# Altium schematic sheet K7410tFFG900MGT.SchDoc
size A3
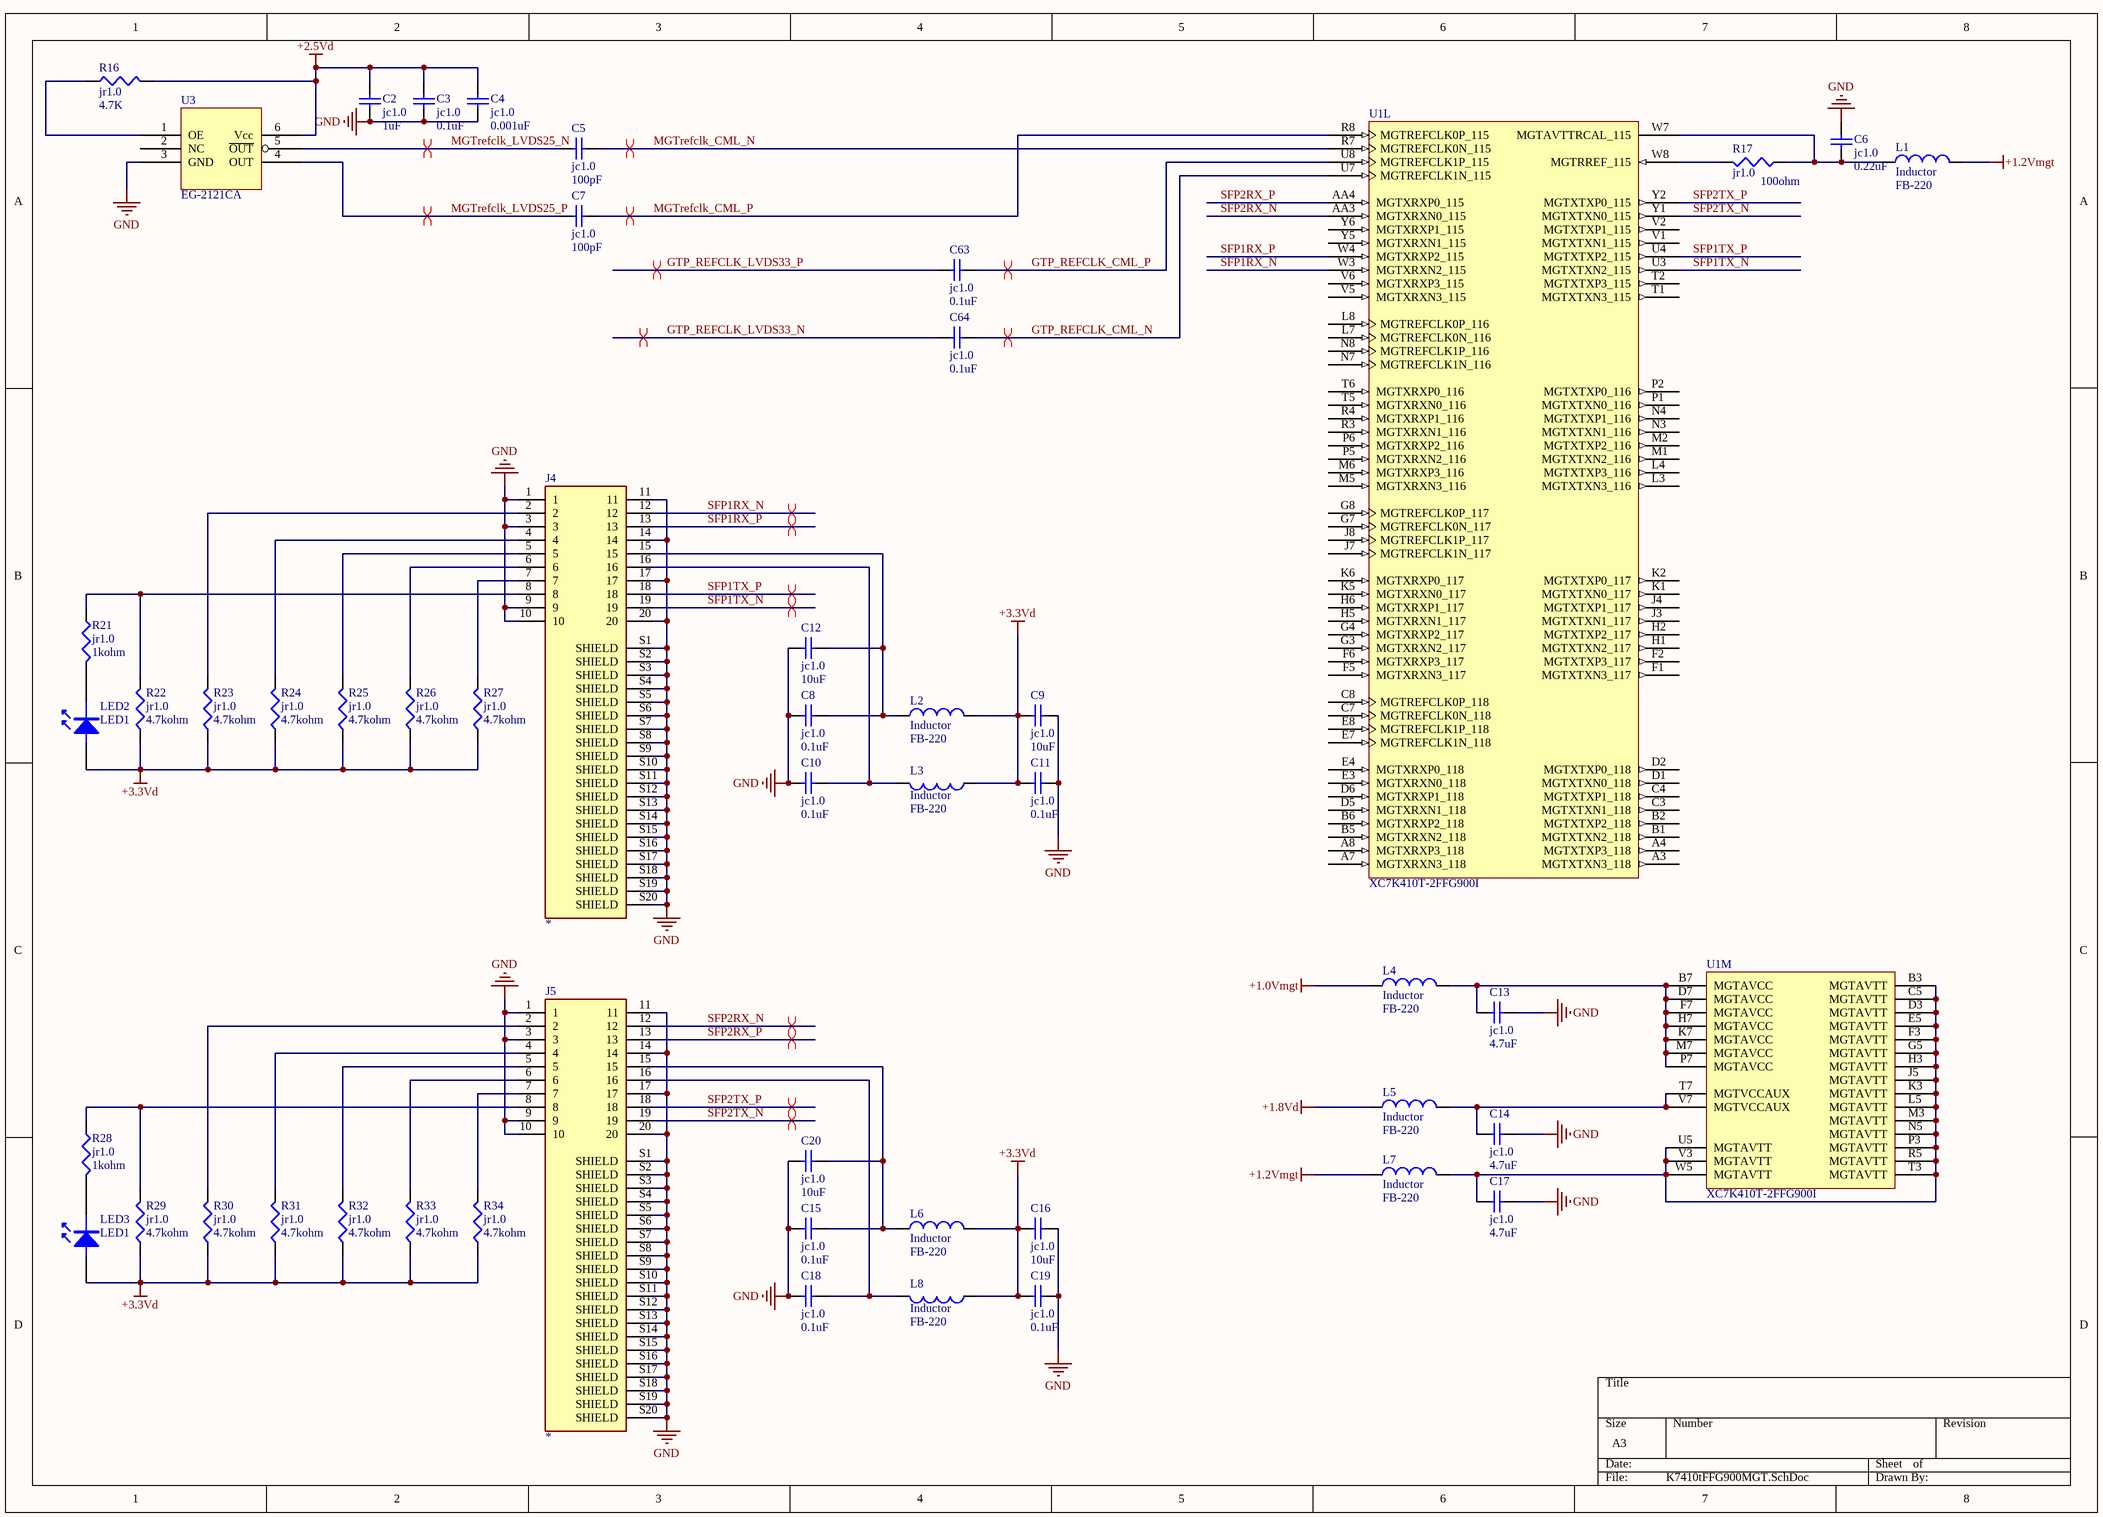
[diagram p0: K7410tFFG900MGT.SchDoc]

## Parts
C2  jc1.0  value 1uF  [0402]
C3  jc1.0  value 0.1uF  [0402]
C4  jc1.0  value 0.001uF  [0402]
C5  jc1.0  value 100pF  [0402]
C6  jc1.0  value 0.22uF  [0402]
C7  jc1.0  value 100pF  [0402]
C8  jc1.0  value 0.1uF  [0805]
C9  jc1.0  value 10uF  [0805]
C10  jc1.0  value 0.1uF  [0805]
C11  jc1.0  value 0.1uF  [0805]
C12  jc1.0  value 10uF  [0805]
C13  jc1.0  value 4.7uF  [0402]
C14  jc1.0  value 4.7uF  [0402]
C15  jc1.0  value 0.1uF  [0805]
C16  jc1.0  value 10uF  [0805]
C17  jc1.0  value 4.7uF  [0402]
C18  jc1.0  value 0.1uF  [0805]
C19  jc1.0  value 0.1uF  [0805]
C20  jc1.0  value 10uF  [0805]
C63  jc1.0  value 0.1uF  [0402]
C64  jc1.0  value 0.1uF  [0402]
J4  2227023-1  [TE_2227023-1]  (value not drawn)
J5  2227023-1  [TE_2227023-1]  (value not drawn)
L1  Inductor  value FB-220  [0603]
L2  Inductor  value FB-220  [1210]
L3  Inductor  value FB-220  [1210]
L4  Inductor  value FB-220  [1210]
L5  Inductor  value FB-220  [1210]
L6  Inductor  value FB-220  [1210]
L7  Inductor  value FB-220  [1210]
L8  Inductor  value FB-220  [1210]
LED2  LED1  [LED1]
LED3  LED1  [LED1]
R16  jr1.0  value 4.7K  [0402]
R17  jr1.0  value 100ohm  [0402]
R21  jr1.0  value 1kohm  [0402]
R22  jr1.0  value 4.7kohm  [0402]
R23  jr1.0  value 4.7kohm  [0402]
R24  jr1.0  value 4.7kohm  [0402]
R25  jr1.0  value 4.7kohm  [0402]
R26  jr1.0  value 4.7kohm  [0402]
R27  jr1.0  value 4.7kohm  [0402]
R28  jr1.0  value 1kohm  [0402]
R29  jr1.0  value 4.7kohm  [0402]
R30  jr1.0  value 4.7kohm  [0402]
R31  jr1.0  value 4.7kohm  [0402]
R32  jr1.0  value 4.7kohm  [0402]
R33  jr1.0  value 4.7kohm  [0402]
R34  jr1.0  value 4.7kohm  [0402]
U1  XC7K410T-2FFG900I  [FFG900]  (parts L,M of 16)
U3  EG-2121CA  [DFN3]

## Nets
+1.0Vmgt: L4.1
+1.2Vmgt: L1.2 L7.1
+1.8Vd: L5.1
+2.5Vd: C2.2 C3.2 C4.2 R16.2 U3.6(Vcc)
+3.3Vd: C9.2 C11.2 C16.2 C19.2 L2.2 L3.1 L6.2 L8.1 LED2.1 LED3.1 R22.1 R23.1 R24.1 R25.1 R26.1 R27.1 R29.1 R30.1 R31.1 R32.1 R33.1 R34.1
GND: C2.1 C3.1 C4.1 C6.1 C8.1 C9.1 C10.1 C11.1 C12.1 C13.1 C14.1 C15.1 C16.1 C17.1 C18.1 C19.1 C20.1 J4.1 J4.3 J4.9 J4.10 J4.11 J4.14 J4.17 J4.20 J4.S1(SHIELD) J4.S2(SHIELD) J4.S3(SHIELD) J4.S4(SHIELD) J4.S5(SHIELD) J4.S6(SHIELD) J4.S7(SHIELD) J4.S8(SHIELD) J4.S9(SHIELD) J4.S10(SHIELD) J4.S11(SHIELD) J4.S12(SHIELD) J4.S13(SHIELD) J4.S14(SHIELD) J4.S15(SHIELD) J4.S16(SHIELD) J4.S17(SHIELD) J4.S18(SHIELD) J4.S19(SHIELD) J4.S20(SHIELD) J5.1 J5.3 J5.9 J5.10 J5.11 J5.14 J5.17 J5.20 J5.S1(SHIELD) J5.S2(SHIELD) J5.S3(SHIELD) J5.S4(SHIELD) J5.S5(SHIELD) J5.S6(SHIELD) J5.S7(SHIELD) J5.S8(SHIELD) J5.S9(SHIELD) J5.S10(SHIELD) J5.S11(SHIELD) J5.S12(SHIELD) J5.S13(SHIELD) J5.S14(SHIELD) J5.S15(SHIELD) J5.S16(SHIELD) J5.S17(SHIELD) J5.S18(SHIELD) J5.S19(SHIELD) J5.S20(SHIELD) U3.3(GND)
GTP_REFCLK_CML_N: C64.2 U1.U7(MGTREFCLK1N_115)
GTP_REFCLK_CML_P: C63.2 U1.U8(MGTREFCLK1P_115)
GTP_REFCLK_LVDS33_N: C64.1
GTP_REFCLK_LVDS33_P: C63.1
MGTrefclk_CML_N: C5.2 U1.R7(MGTREFCLK0N_115)
MGTrefclk_CML_P: C7.2 U1.R8(MGTREFCLK0P_115)
MGTrefclk_LVDS25_N: C5.1 U3.5(~{OUT})
MGTrefclk_LVDS25_P: C7.1 U3.4(OUT)
SFP1RX_N: J4.12 U1.W3(MGTXRXN2_115)
SFP1RX_P: J4.13 U1.W4(MGTXRXP2_115)
SFP1TX_N: J4.19 U1.U3(MGTXTXN2_115)
SFP1TX_P: J4.18 U1.U4(MGTXTXP2_115)
SFP2RX_N: J5.12 U1.AA3(MGTXRXN0_115)
SFP2RX_P: J5.13 U1.AA4(MGTXRXP0_115)
SFP2TX_N: J5.19 U1.Y1(MGTXTXN0_115)
SFP2TX_P: J5.18 U1.Y2(MGTXTXP0_115)
NetC6_2: C6.2 L1.1 R17.1 U1.W7(MGTAVTTRCAL_115)
NetC8_2: C8.2 C12.2 J4.15 L2.1
NetC10_2: C10.2 J4.16 L3.2
NetC13_2: C13.2 L4.2 U1.B7(MGTAVCC) U1.D7(MGTAVCC) U1.F7(MGTAVCC) U1.H7(MGTAVCC) U1.K7(MGTAVCC) U1.M7(MGTAVCC) U1.P7(MGTAVCC)
NetC14_2: C14.2 L5.2 U1.T7(MGTVCCAUX) U1.V7(MGTVCCAUX)
NetC15_2: C15.2 C20.2 J5.15 L6.1
NetC17_2: C17.2 L7.2 U1.B3(MGTAVTT) U1.C5(MGTAVTT) U1.D3(MGTAVTT) U1.E5(MGTAVTT) U1.F3(MGTAVTT) U1.G5(MGTAVTT) U1.H3(MGTAVTT) U1.J5(MGTAVTT) U1.K3(MGTAVTT) U1.L5(MGTAVTT) U1.M3(MGTAVTT) U1.N5(MGTAVTT) U1.P3(MGTAVTT) U1.R5(MGTAVTT) U1.T3(MGTAVTT) U1.U5(MGTAVTT) U1.V3(MGTAVTT) U1.W5(MGTAVTT)
NetC18_2: C18.2 J5.16 L8.2
NetJ4_2: J4.2 R23.2
NetJ4_4: J4.4 R24.2
NetJ4_5: J4.5 R25.2
NetJ4_6: J4.6 R26.2
NetJ4_7: J4.7 R27.2
NetJ4_8: J4.8 R21.1 R22.2
NetJ5_2: J5.2 R30.2
NetJ5_4: J5.4 R31.2
NetJ5_5: J5.5 R32.2
NetJ5_6: J5.6 R33.2
NetJ5_7: J5.7 R34.2
NetJ5_8: J5.8 R28.1 R29.2
NetLED2_2: LED2.2 R21.2
NetLED3_2: LED3.2 R28.2
NetR16_1: R16.1 U3.1(OE)
NetR17_2: R17.2 U1.W8(MGTRREF_115)

Not connected (* = marked no-connect by the designer): U1 A3(MGTXTXN3_118) A4(MGTXTXP3_118) A7(MGTXRXN3_118) A8(MGTXRXP3_118) B1(MGTXTXN2_118) B2(MGTXTXP2_118) B5(MGTXRXN2_118) B6(MGTXRXP2_118) C3(MGTXTXN1_118) C4(MGTXTXP1_118) C7(MGTREFCLK0N_118) C8(MGTREFCLK0P_118) D1(MGTXTXN0_118) D2(MGTXTXP0_118) D5(MGTXRXN1_118) D6(MGTXRXP1_118) E3(MGTXRXN0_118) E4(MGTXRXP0_118) E7(MGTREFCLK1N_118) E8(MGTREFCLK1P_118) F1(MGTXTXN3_117) F2(MGTXTXP3_117) F5(MGTXRXN3_117) F6(MGTXRXP3_117) G3(MGTXRXN2_117) G4(MGTXRXP2_117) G7(MGTREFCLK0N_117) G8(MGTREFCLK0P_117) H1(MGTXTXN2_117) H2(MGTXTXP2_117) H5(MGTXRXN1_117) H6(MGTXRXP1_117) J3(MGTXTXN1_117) J4(MGTXTXP1_117) J7(MGTREFCLK1N_117) J8(MGTREFCLK1P_117) K1(MGTXTXN0_117) K2(MGTXTXP0_117) K5(MGTXRXN0_117) K6(MGTXRXP0_117) L3(MGTXTXN3_116) L4(MGTXTXP3_116) L7(MGTREFCLK0N_116) L8(MGTREFCLK0P_116) M1(MGTXTXN2_116) M2(MGTXTXP2_116) M5(MGTXRXN3_116) M6(MGTXRXP3_116) N3(MGTXTXN1_116) N4(MGTXTXP1_116) N7(MGTREFCLK1N_116) N8(MGTREFCLK1P_116) P1(MGTXTXN0_116) P2(MGTXTXP0_116) P5(MGTXRXN2_116) P6(MGTXRXP2_116) R3(MGTXRXN1_116) R4(MGTXRXP1_116) T1(MGTXTXN3_115) T2(MGTXTXP3_115) T5(MGTXRXN0_116) T6(MGTXRXP0_116) V1(MGTXTXN1_115) V2(MGTXTXP1_115) V5(MGTXRXN3_115) V6(MGTXRXP3_115) Y5(MGTXRXN1_115) Y6(MGTXRXP1_115); U3 2(NC)

## Layout directives
differential pair: GTP_REFCLK_CML_N, GTP_REFCLK_CML_P, GTP_REFCLK_LVDS33_N, GTP_REFCLK_LVDS33_P, MGTrefclk_CML_N, MGTrefclk_CML_P, MGTrefclk_LVDS25_N, MGTrefclk_LVDS25_P, SFP1RX_N, SFP1RX_P, SFP1TX_N, SFP1TX_P, SFP2RX_N, SFP2RX_P, SFP2TX_N, SFP2TX_P

## Library data of the parts
C2-C20 C63 C64 = Cap: Capacitor; Published: 8-Jun-2000; LatestRevisionDate: 17-Jul-2002; LatestRevisionNote: Re-released for DXP Platform.; PackageReference: RAD-0.3; Publisher: Altium Limited
J4 J5 = 2227023-1: Connector Accessories 1 Port SFP Cage Press Fit Right Angle Through Hole Nickel Tray; MF: TE Connectivity; Check_prices: https://www.snapeda.com/parts/2227023-1/TE+Connectivity+AMP+Connectors/view-part/?ref=eda; Value: *; Availability: In Stock; MP: 2227023-1; Price: None; Package: None; SnapEDA_Link: https://www.snapeda.com/parts/2227023-1/TE+Connectivity+AMP+Connectors/view-part/?ref=snap; Purchase-URL: https://pricing.snapeda.com/search/part/2227023-1/?ref=eda; Product_Type: Cage; EU_RoHS_Compliance: Compliant; Comment_1: *
L1-L8 = Inductor: Code_IEC: 1005; Published: 8-Jun-2000; LatestRevisionDate: 17-Jul-2002; LatestRevisionNote: Re-released for DXP Platform.; PackageReference: 0402-A; Publisher: Altium Limited; Code_JEITA: 0402
R16 R17 R21-R34 = Res: Resistor; Published: 8-Jun-2000; LatestRevisionDate: 04-Mar-2005; LatestRevisionNote: PCB Footprint replaced.; PackageReference: J1-0603; Publisher: Altium Limited
U1 = XC7K410T-2FFG900I: Kintex-7 FPGA, 500 User I/Os, 16 GTX, 900-Ball BGA, Speed Grade 2, Industrial Grade, Pb-Free; Manufacturer: Xilinx; GTX: 16; SelectIO HP: 150; SelectIO HR: 350; Speed Grade: -2; DatasheetVersion: v1.12; PackageVersion: Rev 1.1; PackageReference: FFG900; PackageDescription: Flip-Chip BGA, Body 31 x 31 mm, 1.0 mm Pitch; Generic Part Number: XC7K410T; RoHS: Pb-Free; Mounting Technology: Surface Mount; Code_JEDEC: MS-034-AAN-1; PartNumber: XC7K410T-2FFG900I; ComponentLink1Description: Datasheet; ComponentLink1URL: http://www.xilinx.com/support/documentation/data_sheets/ds180_7Series_Overview.pdf; ComponentLink2Description: Package Specification; ComponentLink2URL: http://www.xilinx.com/support/documentation/user_guides/ug865-Zynq-7000-Pkg-Pinout.pdf